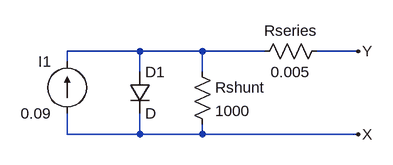
[diagram p0: schematic IVCellModel.asc]
IVCellModel.asc, the LTspice schematic file:
Version 4
SHEET 1 880 680
WIRE 256 144 144 144
WIRE 352 144 256 144
WIRE 448 144 352 144
WIRE 592 144 528 144
WIRE 144 160 144 144
WIRE 256 176 256 144
WIRE 352 176 352 144
WIRE 144 272 144 240
WIRE 256 272 256 240
WIRE 256 272 144 272
WIRE 352 272 352 256
WIRE 352 272 256 272
WIRE 592 272 352 272
FLAG 592 144 Y
FLAG 592 272 X
SYMBOL current 144 240 R180
WINDOW 0 24 80 Left 2
WINDOW 3 24 0 Left 2
WINDOW 123 0 0 Left 0
WINDOW 39 0 0 Left 0
SYMATTR InstName I1
SYMATTR Value 0.09
SYMBOL diode 240 176 R0
SYMATTR InstName D1
SYMBOL res 336 160 R0
SYMATTR InstName Rshunt
SYMATTR Value 1000
SYMBOL res 544 128 R90
WINDOW 0 0 56 VBottom 2
WINDOW 3 32 56 VTop 2
SYMATTR InstName Rseries
SYMATTR Value 0.005

The netlist it stands for:
* IVCellModel.asc
I1 X N001 0.09
D1 N001 X D
Rshunt N001 X 1000
Rseries Y N001 0.005
.model D D
.lib standard.dio
.backanno
.end